# EAGLE design Sensor_Display (EAGLE 6.4)
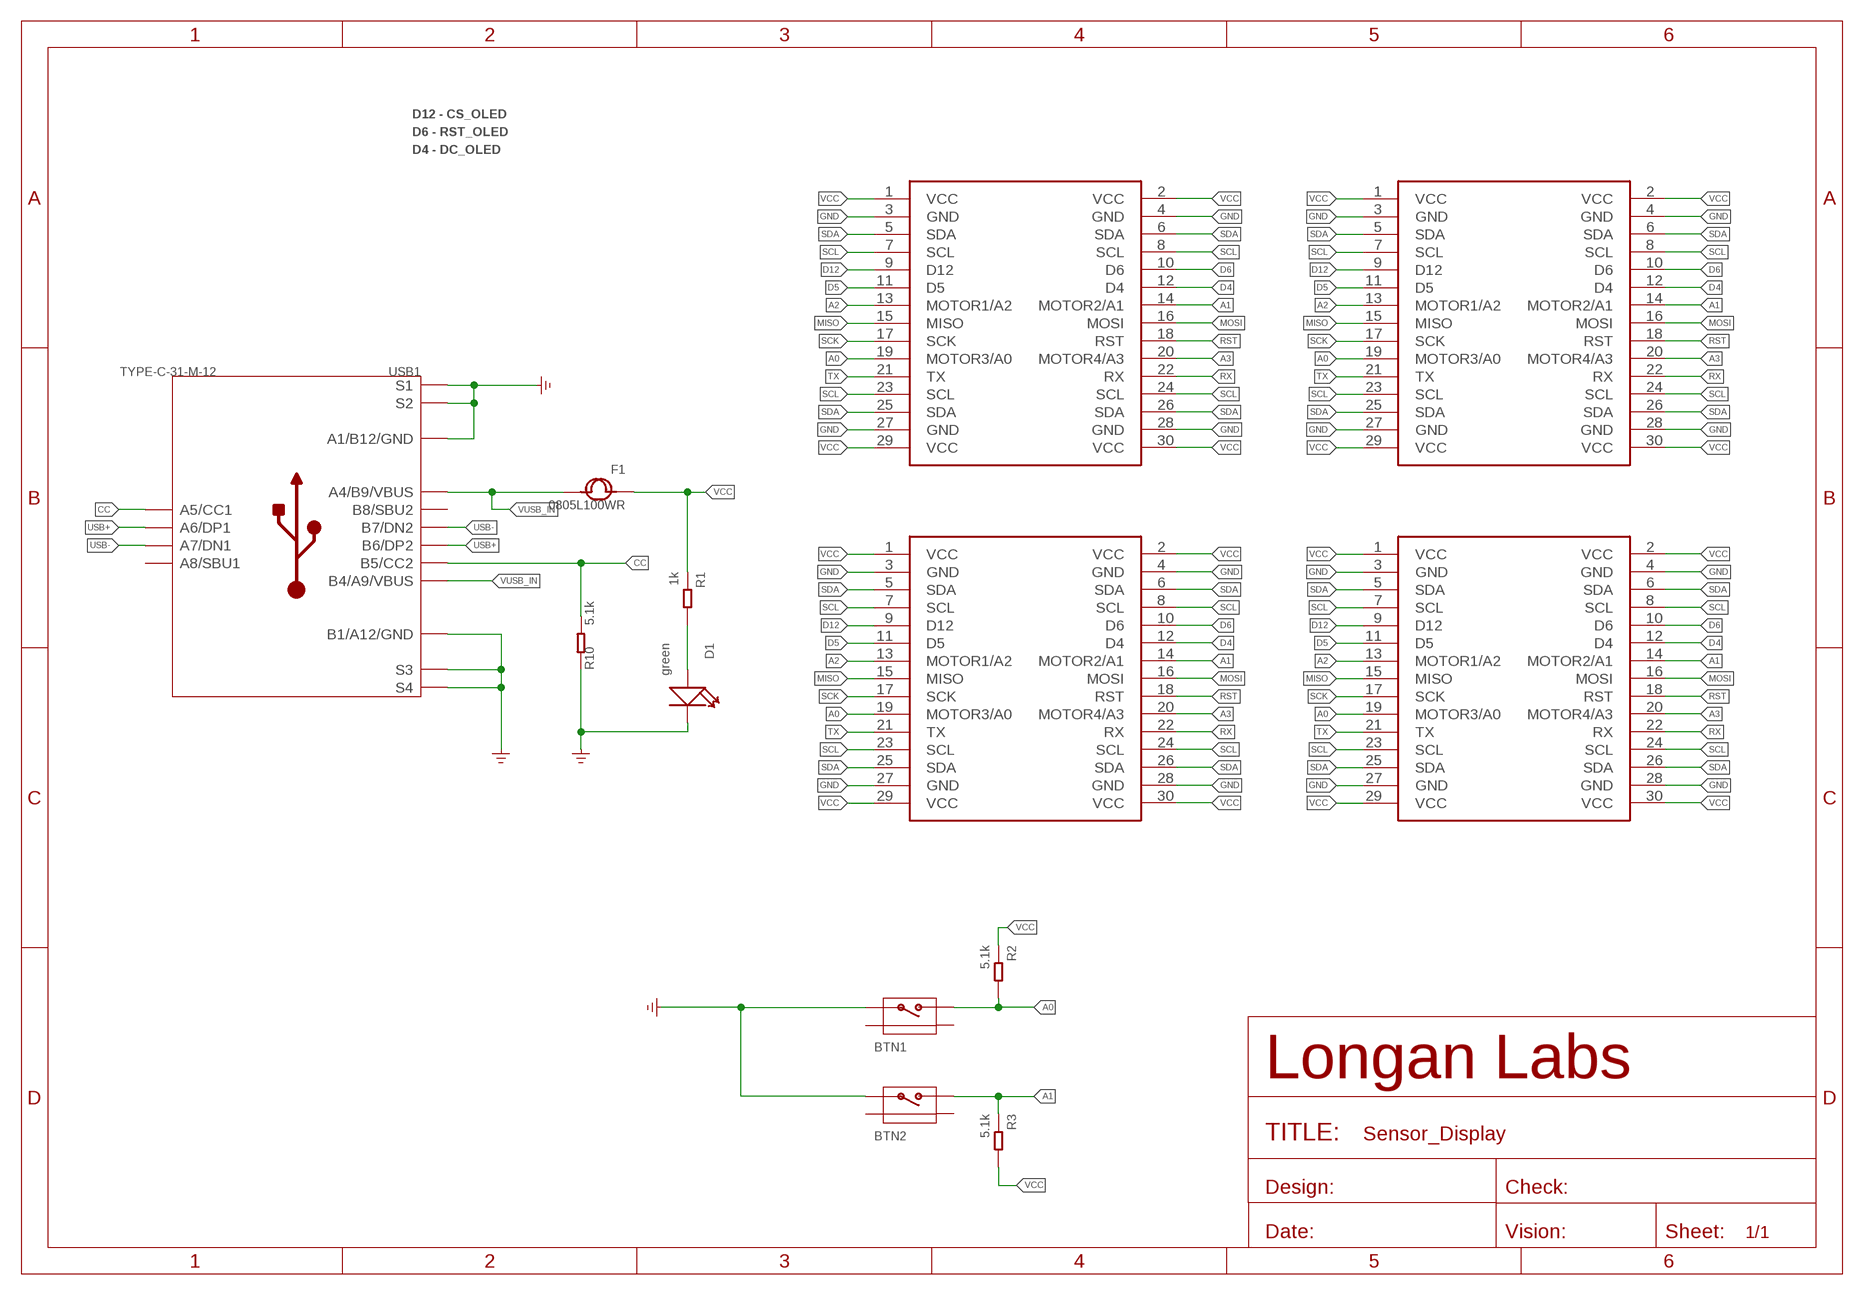
[diagram p0: schematic, sheet 1]

## Parts
BTN1  BUTTON-4P-REINFORCE'TS-1188E'  [4P-SMD-7X3.5X3.5H]
BTN2  BUTTON-4P-REINFORCE'TS-1188E'  [4P-SMD-7X3.5X3.5H]
D1  green  LED'0603'  [LED-0603]
F1  0805L100WR  FUSE0805  [F0805]
MOUDLE1  MOUDLE-2X15P-2.54'90D'  [2X15P-2.54-90D]
MOUDLE2  MOUDLE-2X15P-2.54'2.54'  [2X15P-2.54]
MOUDLE3  MOUDLE-2X15P-2.54'2.54'  [2X15P-2.54]
MOUDLE4  MOUDLE-2X15P-2.54'2.54'  [2X15P-2.54]
R1  1k  RES-0603  [R0603]
R2  5.1k  RES-0603  [R0603]
R3  5.1k  RES-0603  [R0603]
R10  5.1k  RES-0603  [R0603]
USB1  TYPE-C-31-M-12  USB2.0-TYPE-C  [USB2.0-TYPE-C]

## Nets
A0: BTN1.2 MOUDLE1.19(MOTOR3/A0) MOUDLE2.19(MOTOR3/A0) MOUDLE3.19(MOTOR3/A0) MOUDLE4.19(MOTOR3/A0) R2.2
A1: BTN2.2 MOUDLE1.14(MOTOR2/A1) MOUDLE2.14(MOTOR2/A1) MOUDLE3.14(MOTOR2/A1) MOUDLE4.14(MOTOR2/A1) R3.1
A2: MOUDLE1.13(MOTOR1/A2) MOUDLE2.13(MOTOR1/A2) MOUDLE3.13(MOTOR1/A2) MOUDLE4.13(MOTOR1/A2)
A3: MOUDLE1.20(MOTOR4/A3) MOUDLE2.20(MOTOR4/A3) MOUDLE3.20(MOTOR4/A3) MOUDLE4.20(MOTOR4/A3)
CC: R10.2 USB1.A5(A5/CC1) USB1.B5(B5/CC2)
D4: MOUDLE1.12(D4) MOUDLE2.12(D4) MOUDLE3.12(D4) MOUDLE4.12(D4)
D5: MOUDLE1.11(D5) MOUDLE2.11(D5) MOUDLE3.11(D5) MOUDLE4.11(D5)
D6: MOUDLE1.10(D6) MOUDLE2.10(D6) MOUDLE3.10(D6) MOUDLE4.10(D6)
D12: MOUDLE1.9(D12) MOUDLE2.9(D12) MOUDLE3.9(D12) MOUDLE4.9(D12)
GND: BTN1.1 BTN2.1 D1.- MOUDLE1.3(GND) MOUDLE1.4(GND) MOUDLE1.27(GND) MOUDLE1.28(GND) MOUDLE2.3(GND) MOUDLE2.4(GND) MOUDLE2.27(GND) MOUDLE2.28(GND) MOUDLE3.3(GND) MOUDLE3.4(GND) MOUDLE3.27(GND) MOUDLE3.28(GND) MOUDLE4.3(GND) MOUDLE4.4(GND) MOUDLE4.27(GND) MOUDLE4.28(GND) R10.1 USB1.A1_B12(A1/B12/GND) USB1.B1_A12(B1/A12/GND) USB1.S1 USB1.S2 USB1.S3 USB1.S4 USB1.S5(S1) USB1.S6(S2)
MISO: MOUDLE1.15(MISO) MOUDLE2.15(MISO) MOUDLE3.15(MISO) MOUDLE4.15(MISO)
MOSI: MOUDLE1.16(MOSI) MOUDLE2.16(MOSI) MOUDLE3.16(MOSI) MOUDLE4.16(MOSI)
N$2: D1.+ R1.2
RST: MOUDLE1.18(RST) MOUDLE2.18(RST) MOUDLE3.18(RST) MOUDLE4.18(RST)
RX: MOUDLE1.22(RX) MOUDLE2.22(RX) MOUDLE3.22(RX) MOUDLE4.22(RX)
SCK: MOUDLE1.17(SCK) MOUDLE2.17(SCK) MOUDLE3.17(SCK) MOUDLE4.17(SCK)
SCL: MOUDLE1.7(SCL) MOUDLE1.8(SCL) MOUDLE1.23(SCL) MOUDLE1.24(SCL) MOUDLE2.7(SCL) MOUDLE2.8(SCL) MOUDLE2.23(SCL) MOUDLE2.24(SCL) MOUDLE3.7(SCL) MOUDLE3.8(SCL) MOUDLE3.23(SCL) MOUDLE3.24(SCL) MOUDLE4.7(SCL) MOUDLE4.8(SCL) MOUDLE4.23(SCL) MOUDLE4.24(SCL)
SDA: MOUDLE1.5(SDA) MOUDLE1.6(SDA) MOUDLE1.25(SDA) MOUDLE1.26(SDA) MOUDLE2.5(SDA) MOUDLE2.6(SDA) MOUDLE2.25(SDA) MOUDLE2.26(SDA) MOUDLE3.5(SDA) MOUDLE3.6(SDA) MOUDLE3.25(SDA) MOUDLE3.26(SDA) MOUDLE4.5(SDA) MOUDLE4.6(SDA) MOUDLE4.25(SDA) MOUDLE4.26(SDA)
TX: MOUDLE1.21(TX) MOUDLE2.21(TX) MOUDLE3.21(TX) MOUDLE4.21(TX)
USB+: USB1.A6(A6/DP1) USB1.B6(B6/DP2)
USB-: USB1.A7(A7/DN1) USB1.B7(B7/DN2)
VCC: F1.1 MOUDLE1.1(VCC) MOUDLE1.2(VCC) MOUDLE1.29(VCC) MOUDLE1.30(VCC) MOUDLE2.1(VCC) MOUDLE2.2(VCC) MOUDLE2.29(VCC) MOUDLE2.30(VCC) MOUDLE3.1(VCC) MOUDLE3.2(VCC) MOUDLE3.29(VCC) MOUDLE3.30(VCC) MOUDLE4.1(VCC) MOUDLE4.2(VCC) MOUDLE4.29(VCC) MOUDLE4.30(VCC) R1.1 R2.1 R3.2
VUSB_IN: F1.2 USB1.A4_B9(A4/B9/VBUS) USB1.B4_A9(B4/A9/VBUS)
Unconnected: BTN1.S1 BTN1.S2 BTN2.S1 BTN2.S2 USB1.A8(A8/SBU1) USB1.B8(B8/SBU2)

## Notes on the sheet
- D12 - CS_OLED
- D6 - RST_OLED
- D4 - DC_OLED
- E:/Dropbox/Longan/Cards/ԭÀíͼ/Card_25/1016007_Sensor_Display/image/ÕýÃæ.bmp

## Library data of the parts
BTN1 BTN2 = Discrete:BUTTON-4P-REINFORCE: TS-1188E http://www.best-dz.com/?thread-374-2.html
D1 = Discrete-new:LED
F1 = Discrete-small:FUSE
MOUDLE1-MOUDLE4 = Longan-moudle:MOUDLE-2X15P-2.54
R1-R3 R10 = Discrete-new:RES
USB1 = Connector-new:USB2.0-TYPE-C

## Board
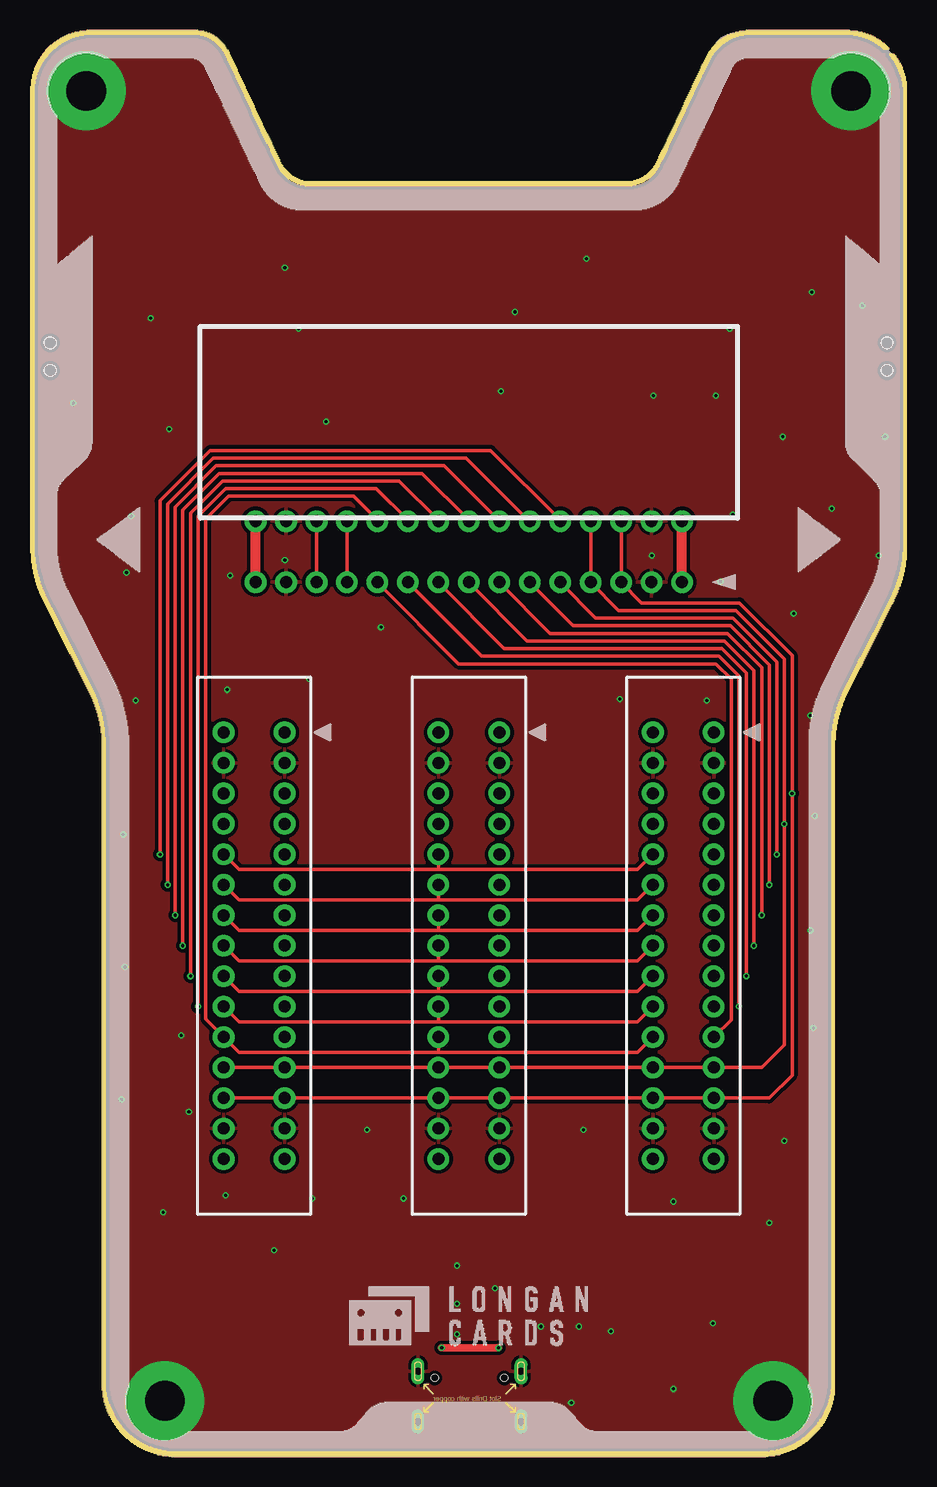
[diagram p1: board, top side]
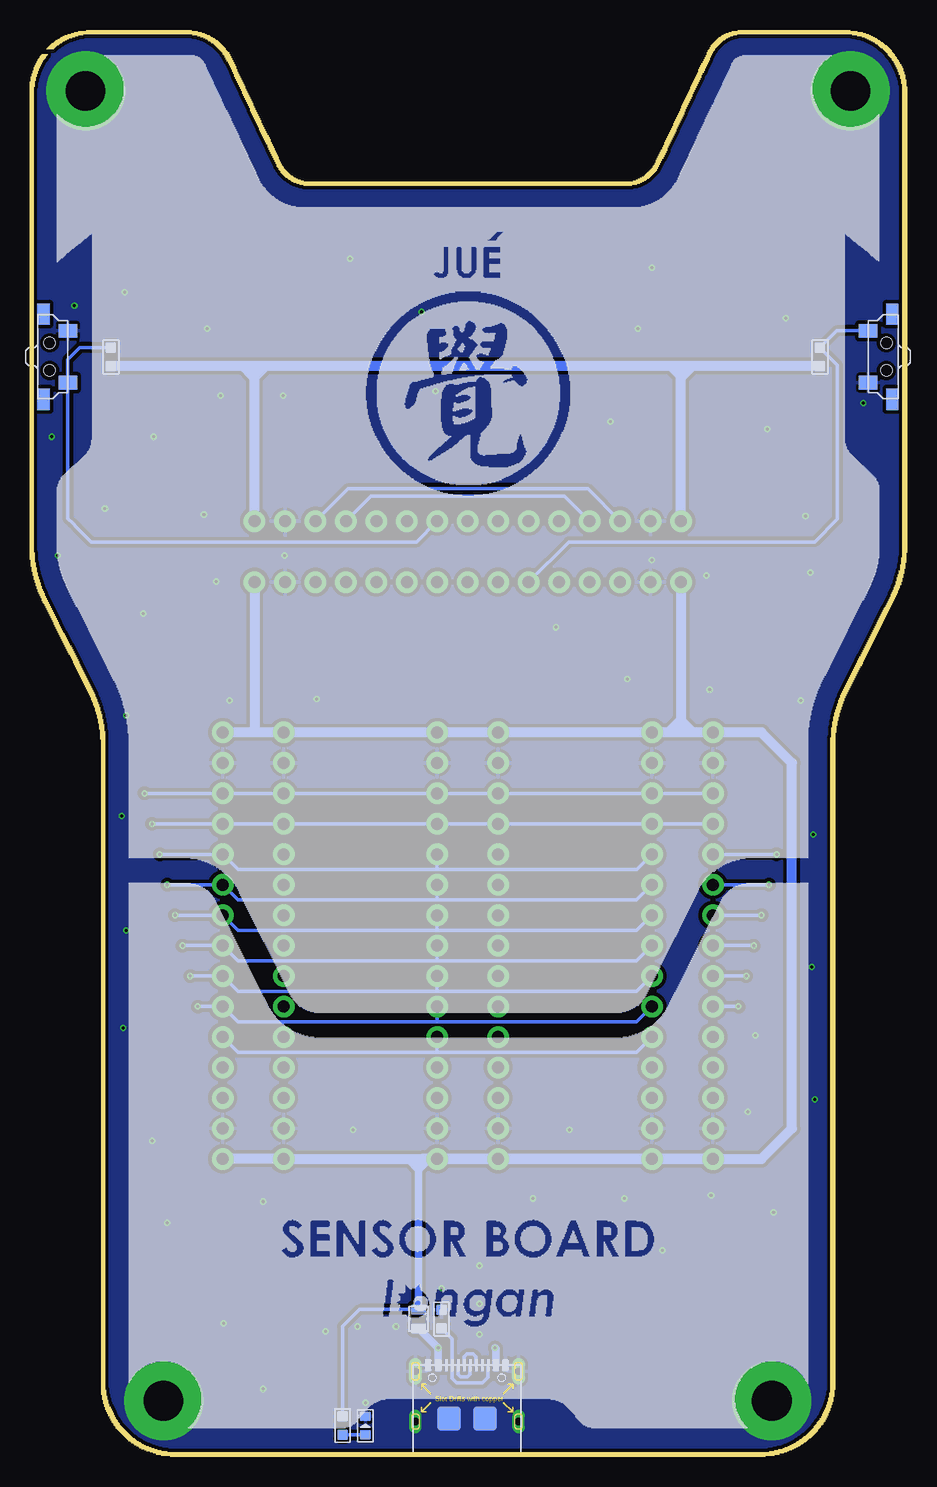
[diagram p2: board, bottom side, seen from below]

Size 73.09 x 118.92 mm. Coordinates in mm from the lower left corner, seen from the top.
Copper layers (1*16): Top 0.035mm / dielectric 1.5mm / Bottom 0.035mm
Design rules "SeeedStudio_2layer_DRU_no_angle_20140221": minimum track width 1mil, minimum drill 10mil, track to track 6mil, track to pad 6mil, pad to pad 6mil, via to via 6mil, smd to smd 0mil, copper to edge 10mil, drill to drill 10mil, minimum pad ring 4mil, minimum via ring 4mil, stop-mask expansion 2mil, vias tented up to drill 25mil, thermal gap 10mil

### Footprints (pad centres in the part's own frame; a part is rotated, then mirrored left to right if it is on the bottom)
4P-SMD-7X3.5X3.5H = smd 1.143 x 1.524: 1 -2.159,1.524; 2 2.159,1.524 | smd 1.778 x 1.016: S1 -3.556,-0.508; S2 3.556,-0.508 | hole 0.95: -1.15,0; 1.15,0
LED-0603 = smd 0.762 x 0.889: + -0.762,0; - 0.762,0
F0805 = smd 0.819 x 1.27: 1 -0.79,0; 2 0.79,0
2X15P-2.54-90D = drill 1 pad 1.8: 1 17.78,-13.335; 2 17.78,-8.255; 3 15.24,-13.335; 4 15.24,-8.255; 5 12.7,-13.335; 6 12.7,-8.255; 7 10.16,-13.335; 8 10.16,-8.255; 9 7.62,-13.335; 10 7.62,-8.255; 11 5.08,-13.335; 12 5.08,-8.255; 13 2.54,-13.335; 14 2.54,-8.255; 15 0,-13.335; 16 0,-8.255; 17 -2.54,-13.335; 18 -2.54,-8.255; 19 -5.08,-13.335; 20 -5.08,-8.255; 21 -7.62,-13.335; 22 -7.62,-8.255; 23 -10.16,-13.335; 24 -10.16,-8.255; 25 -12.7,-13.335; 26 -12.7,-8.255; 27 -15.24,-13.335; 28 -15.24,-8.255; 29 -17.78,-13.335; 30 -17.78,-8.255
2X15P-2.54 = drill 1 pad 1.8: 1 -17.78,2.54; 2 -17.78,-2.54; 3 -15.24,2.54; 4 -15.24,-2.54; 5 -12.7,2.54; 6 -12.7,-2.54; 7 -10.16,2.54; 8 -10.16,-2.54; 9 -7.62,2.54; 10 -7.62,-2.54; 11 -5.08,2.54; 12 -5.08,-2.54; 13 -2.54,2.54; 14 -2.54,-2.54; 15 0,2.54; 16 0,-2.54; 17 2.54,2.54; 18 2.54,-2.54; 19 5.08,2.54; 20 5.08,-2.54; 21 7.62,2.54; 22 7.62,-2.54; 23 10.16,2.54; 24 10.16,-2.54; 25 12.7,2.54; 26 12.7,-2.54; 27 15.24,2.54; 28 15.24,-2.54; 29 17.78,2.54; 30 17.78,-2.54
R0603 = smd 0.889 x 0.889: 1 0,0.762; 2 0,-0.762
USB2.0-TYPE-C = smd 1 x 0.6: A1_B12 -0.05,3.25; A4_B9 -0.05,2.4; B1_A12 -0.05,-3.2; B4_A9 -0.05,-2.4 | smd 1 x 0.3: A5 -0.05,1.25; A6 -0.05,0.25; A7 -0.05,-0.25; A8 -0.05,-1.25; B5 -0.05,-1.75; B6 -0.05,-0.75; B7 -0.05,0.75; B8 -0.05,1.75 | drill 0.6 pad 1 long: S1 -4.75,4.3; S2 -4.75,-4.3 | drill 0.6 pad 1.1 long: S3 -0.55,4.3; S4 -0.55,-4.3 | smd 2 x 2: S5 -4.5,1.5; S6 -4.5,-1.5 | hole 0.6: -1.1,-2.89; -1.1,2.89

### Placement (x,y rotation side)
BTN1  1.69,91.68 90 bottom
BTN2  71.45,91.68 270 bottom
D1  45.13,2.58 90 bottom
F1  40.68,11.47 270 bottom
MOUDLE1  36.59,86.22 0 top
MOUDLE2  18.69,42.59 270 top
MOUDLE3  36.59,42.59 270 top
MOUDLE4  54.47,42.59 270 top
R1  47.03,2.58 0 bottom
R2  7.22,91.68 180 bottom
R3  66.34,91.68 0 bottom
R10  38.78,11.47 0 bottom
USB1  36.65,7.66 90 bottom

### Tracks (layer width: path | path; a pad name or v marks a point on that pad's centre or on a via)
A0  (via drill 0.25 pad 0.51)
  Top 0.305: MOUDLE1.19 31.51,72.84 37.63,66.72 57.45,66.72 59.1,65.07 v59.1,37.51
  Bottom 0.305: BTN1.2 5.82,93.84 R2.2 5.76,90.97 5.76,78.15 7.66,76.24 28.16,76.24 MOUDLE1.19 | MOUDLE2.19 21.25,37.51 22.52,36.24 39.03,36.24 | 39.03,36.24 55.74,36.24 MOUDLE4.19 v59.1,37.51 | MOUDLE3.19 39.13,36.34 39.03,36.24
A1  (via drill 0.25 pad 0.51)
  Top 0.305: MOUDLE2.14 16.17,45.13 17.44,43.86 34.08,43.86 | 34.08,43.86 50.66,43.86 MOUDLE4.14 | MOUDLE3.14 34.05,43.88 34.08,43.86 | v12.11,45.13 12.11,79.16 15.54,82.59 34.51,82.59 MOUDLE1.14 39.13,77.92
  Bottom 0.305: R3.1 68.93,92.44 69.93,91.45 BTN2.2 69.93,78.18 69.55,77.8 69.19,77.45 67.99,76.24 40.86,76.24 MOUDLE1.14 | v12.11,45.13 MOUDLE2.14
A2  (via drill 0.25 pad 0.51)
  Top 0.305: MOUDLE1.13 39.13,72.84 43.35,68.62 58.16,68.62 61,65.78 v61,45.13
  Bottom 0.305: MOUDLE2.13 21.25,45.13 22.52,43.86 39.03,43.86 | 39.03,43.86 55.74,43.86 MOUDLE4.13 v61,45.13 | MOUDLE3.13 39.13,43.96 39.03,43.86
A3  (via drill 0.25 pad 0.51)
  Top 0.305: MOUDLE2.20 16.17,37.51 17.44,36.24 34.08,36.24 | 34.08,36.24 50.66,36.24 MOUDLE4.20 | MOUDLE3.20 34.05,36.26 34.08,36.24 | MOUDLE1.20 31.51,78.05 28.87,80.69 16.3,80.69 14.01,78.4 v14.01,37.51
  Bottom 0.305: v14.01,37.51 MOUDLE2.20
CC
  Bottom 0.305: USB1.B5 34.9,6.59 35.35,6.14 37.53,6.14 37.9,6.51 USB1.A5 37.9,9.83 R10.2
D4  (via drill 0.25 pad 0.51)
  Top 0.305: MOUDLE2.12 16.17,47.67 17.44,46.4 34.08,46.4 | 34.08,46.4 50.66,46.4 MOUDLE4.12 | MOUDLE3.12 34.05,46.42 34.08,46.4 | MOUDLE1.12 41.62,77.97 36.36,83.23 15.28,83.23 11.47,79.42 v11.47,47.67
  Bottom 0.305: v11.47,47.67 MOUDLE2.12
D5  (via drill 0.25 pad 0.51)
  Top 0.305: MOUDLE1.11 41.67,72.84 45.25,69.26 58.38,69.26 61.64,66 v61.64,47.67
  Bottom 0.305: MOUDLE2.11 21.25,47.67 22.52,46.4 39.16,46.4 | 39.16,46.4 55.74,46.4 MOUDLE4.11 v61.64,47.67 | MOUDLE3.11 39.13,46.42 39.16,46.4
D6  (via drill 0.25 pad 0.51)
  Top 0.305: MOUDLE2.10 16.17,50.21 17.44,48.94 34.08,48.94 | 34.08,48.94 50.66,48.94 MOUDLE4.10 | MOUDLE3.10 34.05,48.96 34.08,48.94 | MOUDLE1.10 44.21,78.05 38.4,83.86 15.03,83.86 10.84,79.67 v10.84,50.21
  Bottom 0.305: v10.84,50.21 MOUDLE2.10
D12  (via drill 0.25 pad 0.51)
  Top 0.305: MOUDLE1.9 44.21,72.84 47.16,69.89 58.62,69.89 62.27,66.24 v62.27,50.21
  Bottom 0.305: 39.16,48.94 55.74,48.94 MOUDLE4.9 v62.27,50.21 | 39.16,48.94 22.5,48.94 MOUDLE2.9 | MOUDLE3.9 39.13,48.96 39.16,48.94
GND  (via drill 0.25 pad 0.51, 3.3 pad 6.6)
  other vias: 35.6,12.74 35.6,10.2 38.78,14.01 35.6,15.92 53.64,5.63 20.36,17.19 31.16,21.51 23.54,21.51 16.3,21.76 11.09,20.36 65.45,53.38 65.07,43.86 61.64,19.47 53.64,21.25 48.43,10.46 56.94,11.09 4.69,113.85 68.45,113.85 11.23,4.65 61.95,4.65 11.6,85.64 10.08,94.91 21.25,99.1 46.4,99.86 65.19,97.07 62.78,85.01 51.99,88.43 24.68,86.28 45.13,4.49 42.59,10.84 45.76,10.84 12.62,35.09 13.25,28.74 28.11,27.22 46.14,27.22 65.32,35.73 62.91,26.33 56.43,63.03 49.19,63.16 29.25,69.13 23.28,64.81 16.68,73.45 16.43,63.92 21.25,74.72 8.04,73.7 8.81,63.03 7.79,51.86 7.92,40.81 7.66,29.76 8.42,78.4 3.6,87.8 22.39,94.02 40.43,95.42 39.29,88.82 58.34,94.02 57.19,88.43 71.29,85.01 69.38,95.93 58.59,78.53 66.84,79.04 70.78,75.1 51.86,75.1 57.57,72.94 63.67,70.27 65.07,61.76
  pour Top (isolate 0.305): -1.74,120.31 75.73,120.57 75.73,-4.66 -1.74,-4.91
  pour Bottom (isolate 0.305): -1.74,120.31 75.61,120.18 75.61,-5.04 -1.74,-4.91
MISO  (via drill 0.25 pad 0.51)
  Top 0.305: MOUDLE1.15 36.59,72.84 41.44,67.99 57.9,67.99 60.37,65.52 v60.37,42.59
  Bottom 0.305: MOUDLE2.15 21.25,42.59 22.52,41.32 39.03,41.32 | 39.03,41.32 55.74,41.32 MOUDLE4.15 v60.37,42.59 | MOUDLE3.15 39.13,41.42 39.03,41.32
MOSI  (via drill 0.25 pad 0.51)
  Top 0.305: MOUDLE2.16 16.17,42.59 17.44,41.32 33.95,41.32 | 33.95,41.32 50.66,41.32 MOUDLE4.16 | MOUDLE3.16 34.05,41.42 33.95,41.32 | MOUDLE1.16 36.59,78.05 32.68,81.96 15.79,81.96 12.74,78.91 v12.74,42.59
  Bottom 0.305: v12.74,42.59 MOUDLE2.16
N$2
  Bottom 0.305: R1.2 D1.+
RST  (via drill 0.25 pad 0.51)
  Top 0.305: MOUDLE2.18 16.17,40.05 17.44,38.78 34.08,38.78 | 34.08,38.78 50.66,38.78 MOUDLE4.18 | MOUDLE3.18 34.05,38.8 34.08,38.78 | MOUDLE1.18 34.05,78.05 30.78,81.32 16.04,81.32 13.38,78.66 v13.38,40.05
  Bottom 0.305: v13.38,40.05 MOUDLE2.18
RX
  Top 0.305: 34.08,33.7 17.44,33.7 16.17,34.97 MOUDLE2.22 14.65,36.47 14.65,78.15 16.55,80.05 26.97,80.05 28.97,78.05 MOUDLE1.22 | 34.08,33.7 50.66,33.7 MOUDLE4.22 | MOUDLE3.22 34.05,33.72 34.08,33.7
SCK  (via drill 0.25 pad 0.51)
  Top 0.305: MOUDLE1.17 34.05,72.84 39.54,67.35 57.68,67.35 59.73,65.3 v59.73,40.05
  Bottom 0.305: MOUDLE2.17 21.25,40.05 22.52,38.78 39.16,38.78 | 39.16,38.78 55.74,38.78 MOUDLE4.17 v59.73,40.05 | MOUDLE3.17 39.13,38.8 39.16,38.78
SCL  (via drill 0.25 pad 0.51)
  Top 0.305: MOUDLE2.24 MOUDLE2.23 MOUDLE3.24 MOUDLE3.23 MOUDLE4.24 MOUDLE4.23 61,32.43 62.91,34.33 v62.91,52.75 62.91,66.49 58.87,70.53 49.06,70.53 46.75,72.84 MOUDLE1.7 MOUDLE1.8 | MOUDLE1.23 MOUDLE1.24
  Bottom 0.305: MOUDLE1.24 28.52,80.05 44.67,80.05 MOUDLE1.8 | MOUDLE2.8 MOUDLE2.7 MOUDLE3.8 MOUDLE3.7 MOUDLE4.8 MOUDLE4.7 v62.91,52.75
SDA  (via drill 0.25 pad 0.51)
  Top 0.305: MOUDLE2.26 MOUDLE2.25 MOUDLE3.26 MOUDLE3.25 MOUDLE4.26 MOUDLE4.25 61.64,29.89 63.54,31.79 v63.54,55.29 63.54,66.78 59.16,71.16 50.97,71.16 49.29,72.84 MOUDLE1.5 MOUDLE1.6 | MOUDLE1.25 MOUDLE1.26
  Bottom 0.305: MOUDLE1.26 23.89,78 26.59,80.69 46.58,80.69 MOUDLE1.6 | MOUDLE2.6 MOUDLE2.5 MOUDLE3.6 MOUDLE3.5 MOUDLE4.6 MOUDLE4.5 v63.54,55.29
TX
  Top 0.305: MOUDLE1.21 28.97,72.84 35.73,66.08 57.19,66.08 58.46,64.81 58.46,36.42 MOUDLE4.21
  Bottom 0.305: MOUDLE2.21 21.25,34.97 22.52,33.7 39.16,33.7 | 39.16,33.7 55.74,33.7 MOUDLE4.21 | MOUDLE3.21 39.13,33.72 39.16,33.7
USB+
  Bottom 0.305: USB1.B6 35.9,8.31 36.14,8.55 36.65,8.55 36.9,8.3 USB1.A6
USB-
  Bottom 0.305: USB1.A7 36.4,6.87 36.62,6.65 37.21,6.65 37.4,6.84 USB1.B7
VCC
  Top 0.813: MOUDLE1.1 MOUDLE1.2 | MOUDLE1.29 MOUDLE1.30
  Bottom 0.305: F1.1 45.61,12.26 47.03,10.84 R1.1
  Bottom 0.61: F1.1 40.68,23.92 | 40.68,23.92 40.68,24.55 40.43,24.81 | 40.68,23.92 39.79,24.81 | 40.68,23.92 41.57,24.81
  Bottom 0.813: R2.1 17.88,90.92 | 17.88,90.92 18.84,90.92 | 18.84,90.92 53.44,90.92 | 53.44,90.92 R3.2 | 18.81,90.89 18.84,90.92 | 17.88,90.92 18.71,90.09 | 18.71,90.09 18.84,90.09 19.6,90.85 | MOUDLE1.30 18.81,89.98 18.71,90.09 | MOUDLE2.30 MOUDLE2.29 MOUDLE3.30 MOUDLE3.29 | MOUDLE3.29 39.79,24.81 40.43,24.81 41.57,24.81 MOUDLE4.30 MOUDLE4.29 | 17.82,60.37 MOUDLE2.2 12.11,60.37 9.57,57.83 9.57,27.35 12.11,24.81 MOUDLE3.29 | 17.82,60.37 18.71,60.37 | 18.71,60.37 19.85,60.37 | 19.85,60.37 MOUDLE2.1 MOUDLE3.2 MOUDLE3.1 MOUDLE4.2 54.27,60.37 | 54.27,60.37 MOUDLE4.1 | MOUDLE1.29 18.81,62.06 18.81,61.41 | 18.81,61.41 18.81,60.47 18.71,60.37 | MOUDLE1.1 54.37,60.47 54.27,60.37 | MOUDLE1.2 54.37,90.82 54.4,90.85 | 53.44,90.92 54.27,90.09 54.53,90.09 55.29,90.85 | 18.81,61.41 19.85,60.37 | 18.81,61.41 18.81,61.36 17.82,60.37
VUSB_IN  (via drill 0.25 pad 0.51)
  Top 0.61: v34.33,9.06 39.04,9.06 v39.05,9.05
  Bottom 0.61: USB1.A4_B9 v39.05,9.05 40,10 F1.2 | USB1.B4_A9 34.25,8.98 v34.33,9.06